# EAGLE schematic v.0.0.0 (EAGLE 5.11)

## Sheet 1 of 10
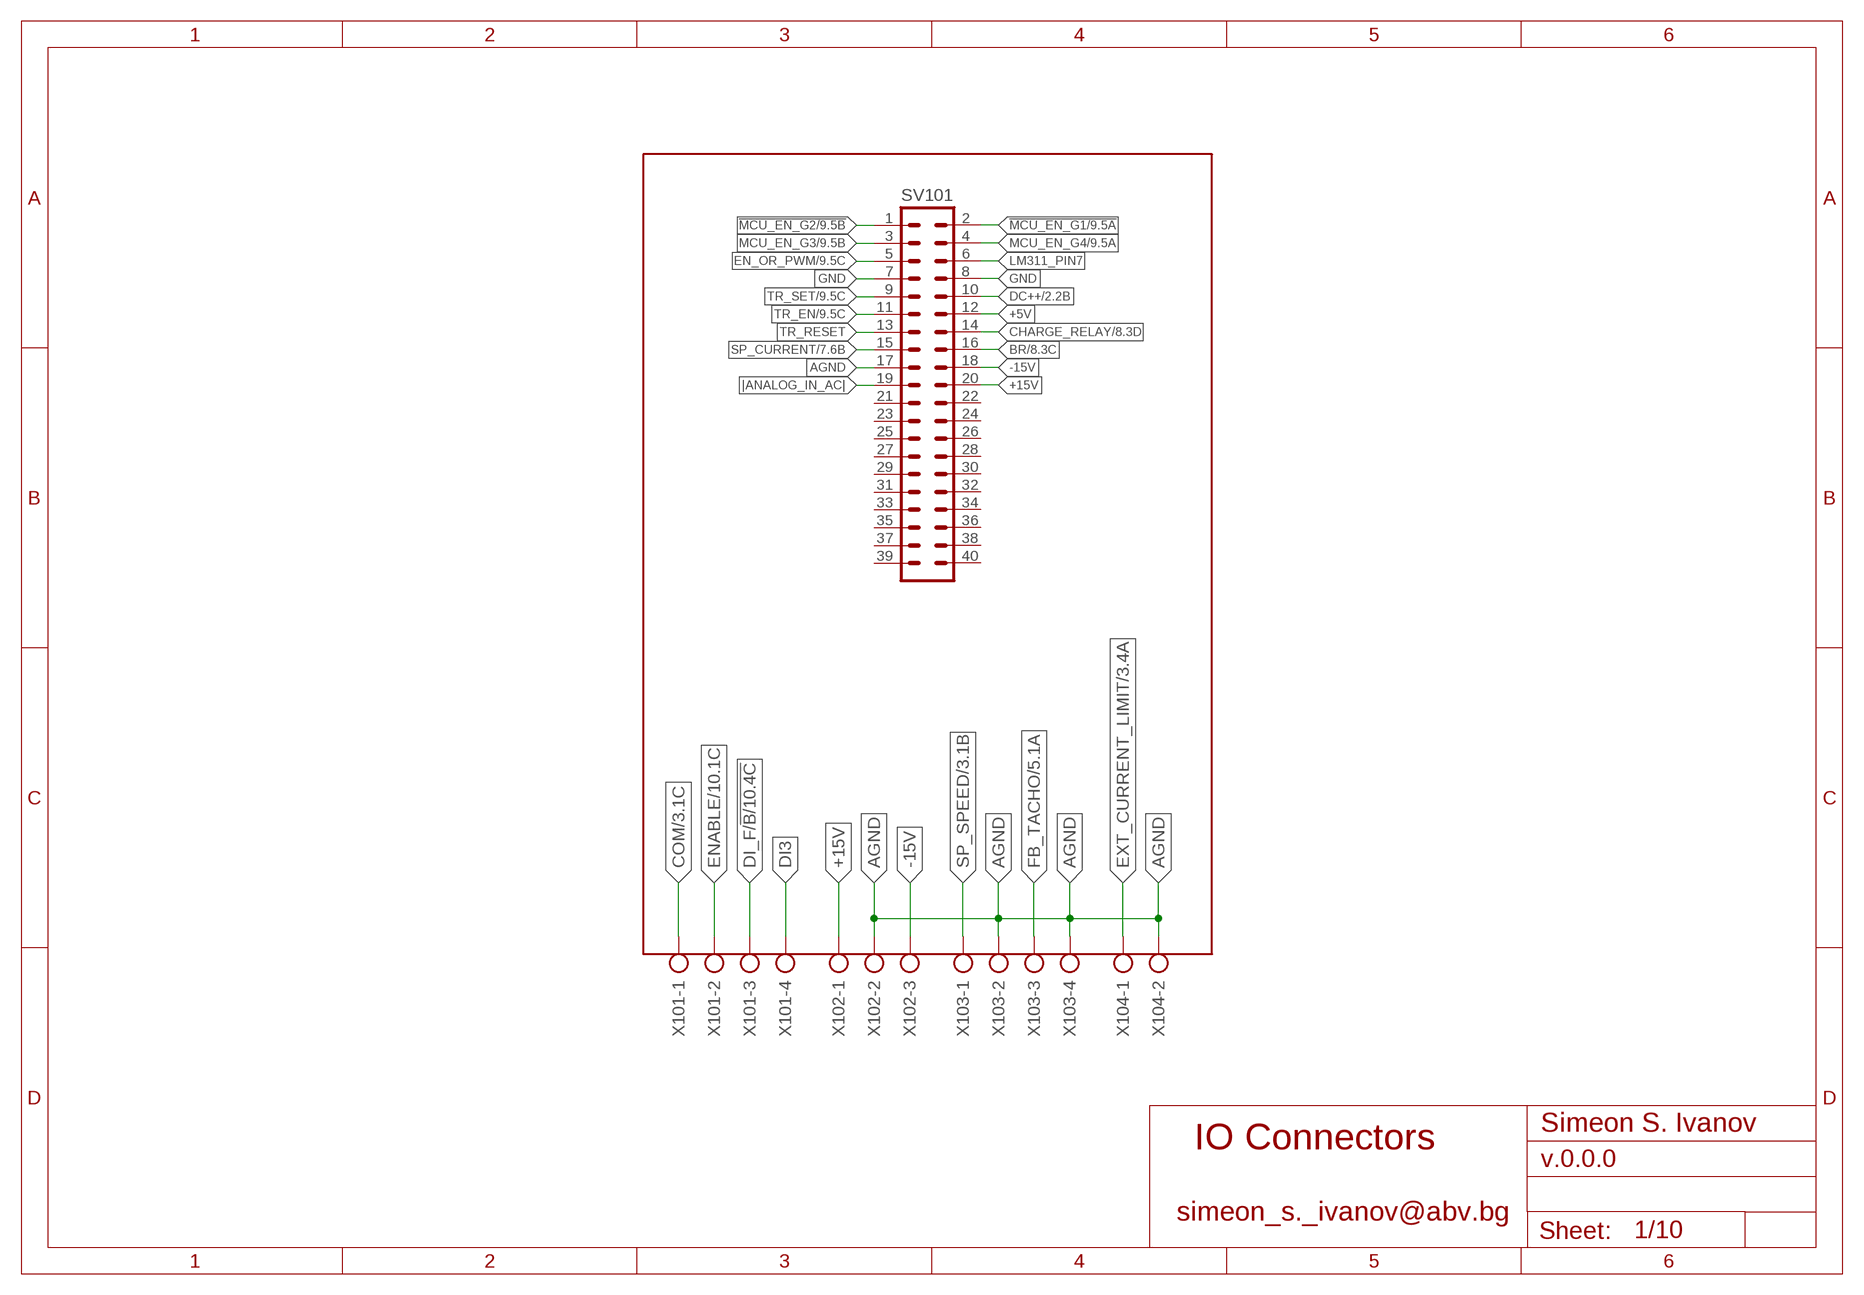
[diagram p0: schematic, sheet 1]

### Parts
SV101  ML40  [ML40]
X101  AK500/4-H  [AK500/4-H]
X102  AK500/3-H  [AK500/3-H]
X103  AK500/4-H  [AK500/4-H]
X104  AK500/2-H  [AK500/2-H]

### Nets
!MCU_EN_G1: SV101.2 ; also sheet 9
!MCU_EN_G2: SV101.1 ; also sheet 9
+5V: SV101.12 ; also sheet 2,8,9,10
+15V: SV101.20 X102.1 ; also sheet 2,3,4,5,6,7,8
-15V: SV101.18 X102.3 ; also sheet 2,3,4,5,6,7,8
AGND: SV101.17 X102.2 X103.2 X103.4 X104.2 ; also sheet 2,3,4,5,6,7,8
BR: SV101.16 ; also sheet 8
CHARGE_RELAY: SV101.14 ; also sheet 8
COM: X101.1 ; also sheet 3,10
DC++: SV101.10 ; also sheet 2,8
DI3: X101.4
DI_F/!B: X101.3 ; also sheet 10
EN_OR_PWM: SV101.5 ; also sheet 9
ENABLE: X101.2 ; also sheet 10
EXT_CURRENT_LIMIT: X104.1 ; also sheet 3
FB_TACHO: X103.3 ; also sheet 5
GND: SV101.7 SV101.8 ; also sheet 2,8,9,10
LM311_PIN7: SV101.6
MCU_EN_G3: SV101.3 ; also sheet 9
MCU_EN_G4: SV101.4 ; also sheet 9
SP_CURRENT: SV101.15 ; also sheet 7
SP_SPEED: X103.1 ; also sheet 3
TR_EN: SV101.11 ; also sheet 9
TR_RESET: SV101.13
TR_SET: SV101.9 ; also sheet 9
|ANALOG_IN_AC|: SV101.19
Unconnected: SV101.21 SV101.22 SV101.23 SV101.24 SV101.25 SV101.26 SV101.27 SV101.28 SV101.29 SV101.30 SV101.31 SV101.32 SV101.33 SV101.34 SV101.35 SV101.36 SV101.37 SV101.38 SV101.39 SV101.40

### Notes on the sheet
- Simeon S. Ivanov
- IO Connectors
- simeon_s._ivanov@abv.bg

## Sheet 2 of 10
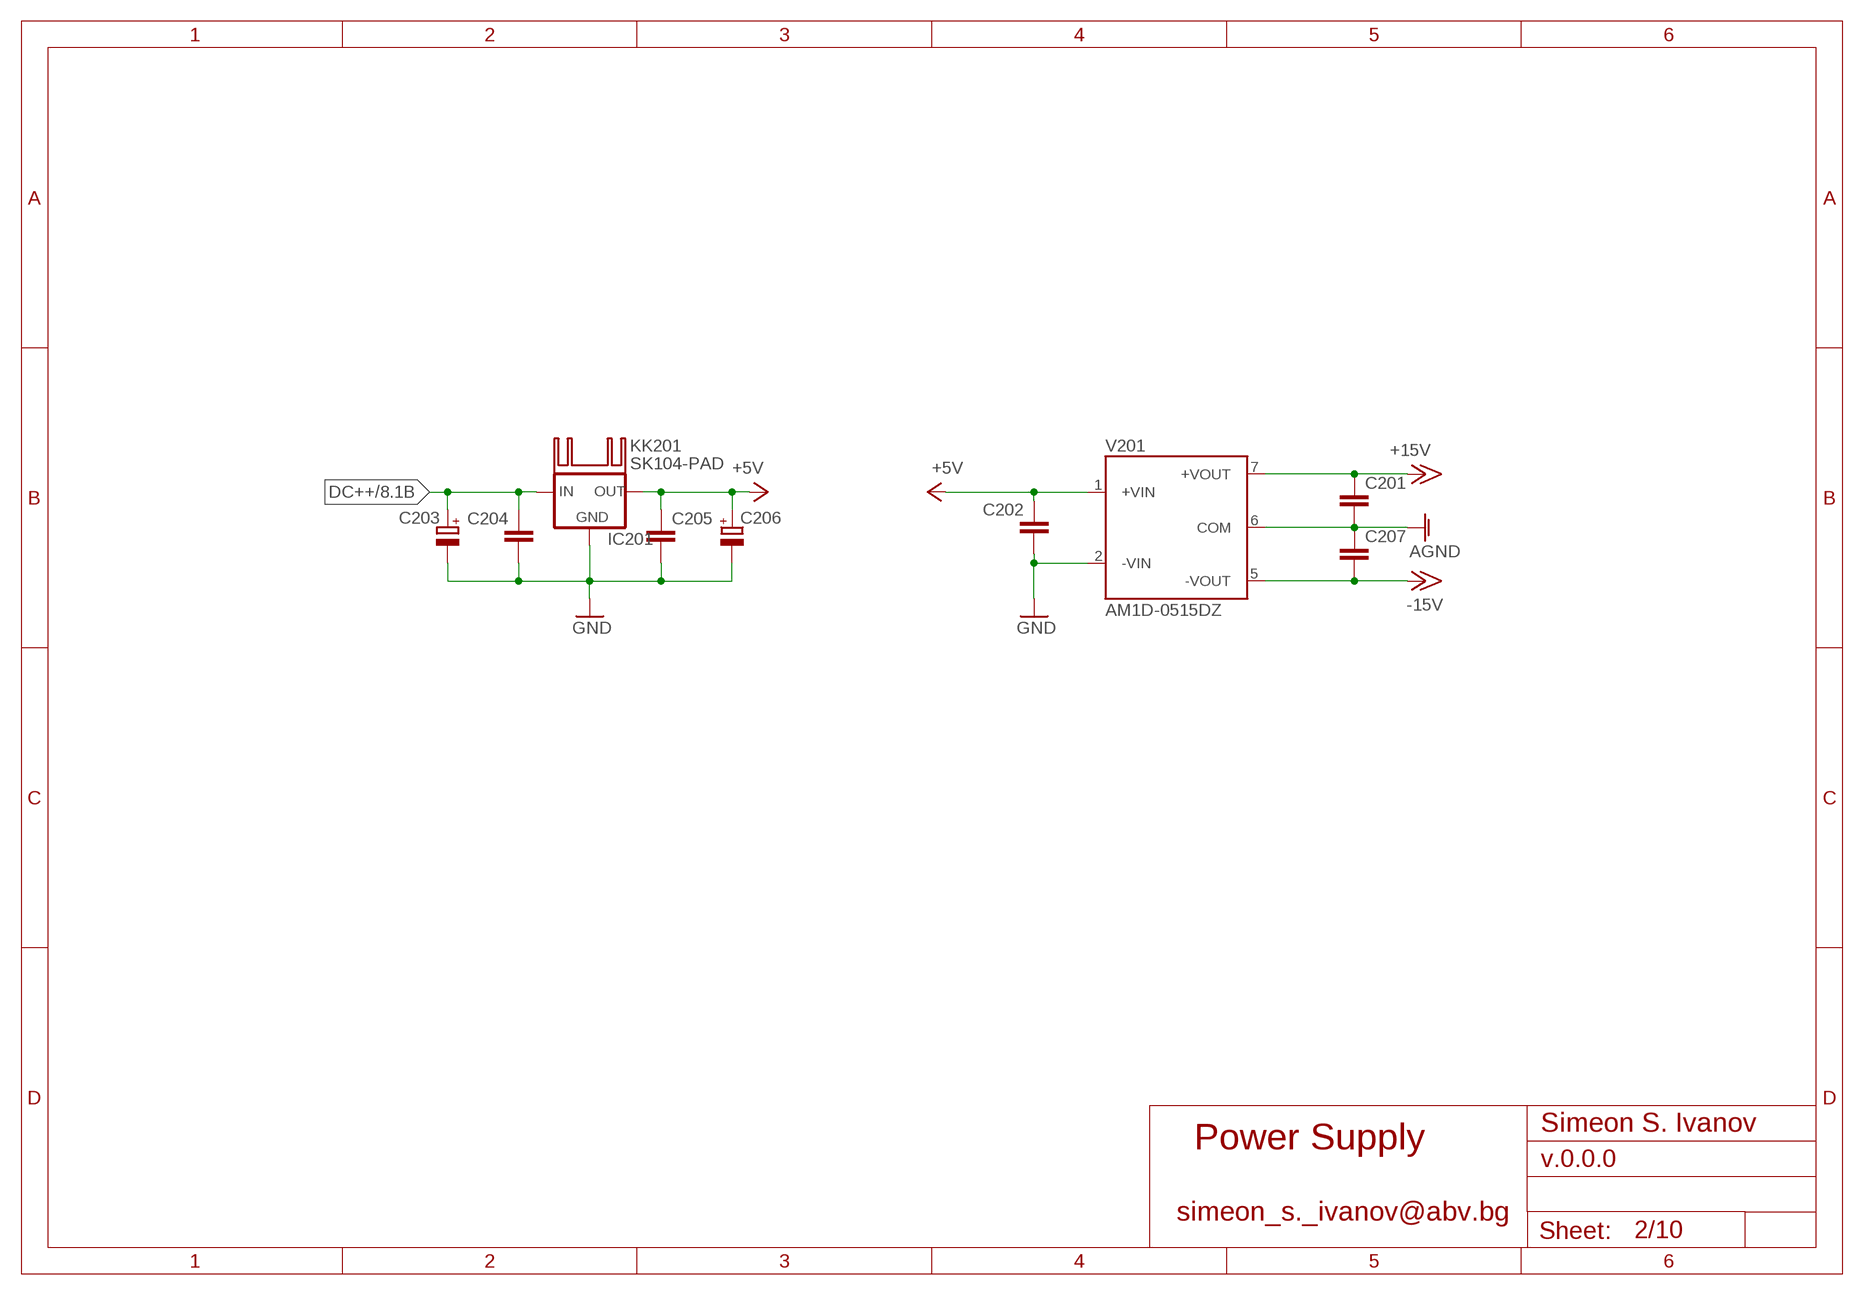
[diagram p1: schematic, sheet 2]

### Parts
C201  C-EUC1206  [C1206]
C202  C-EUC1206  [C1206]
C203  CPOL-EUE2.5-6  [E2,5-6]
C204  C-EUC1206  [C1206]
C205  C-EUC1206  [C1206]
C206  CPOL-EUE2.5-6  [E2,5-6]
C207  C-EUC1206  [C1206]
IC201  78XXS  [78XXS]
KK201  SK104-PAD  [SK104-PAD]
V201  AM1D-0515DZ  TMA0515D  [TMA_DUAL]

### Nets
+5V: C202.1 C205.1 C206.+ IC201.OUT V201.1(+VIN) ; also sheet 1,8,9,10
+15V: C201.1 V201.7(+VOUT) ; also sheet 1,3,4,5,6,7,8
-15V: C207.2 V201.5(-VOUT) ; also sheet 1,3,4,5,6,7,8
AGND: C201.2 C207.1 V201.6(COM) ; also sheet 1,3,4,5,6,7,8
DC++: C203.+ C204.1 IC201.IN ; also sheet 1,8
GND: C202.2 C203.- C204.2 C205.2 C206.- IC201.GND V201.2(-VIN) ; also sheet 1,8,9,10
Unconnected: KK201.K1(K) KK201.K2(K)

### Notes on the sheet
- Simeon S. Ivanov
- Power Supply
- simeon_s._ivanov@abv.bg

## Sheet 3 of 10
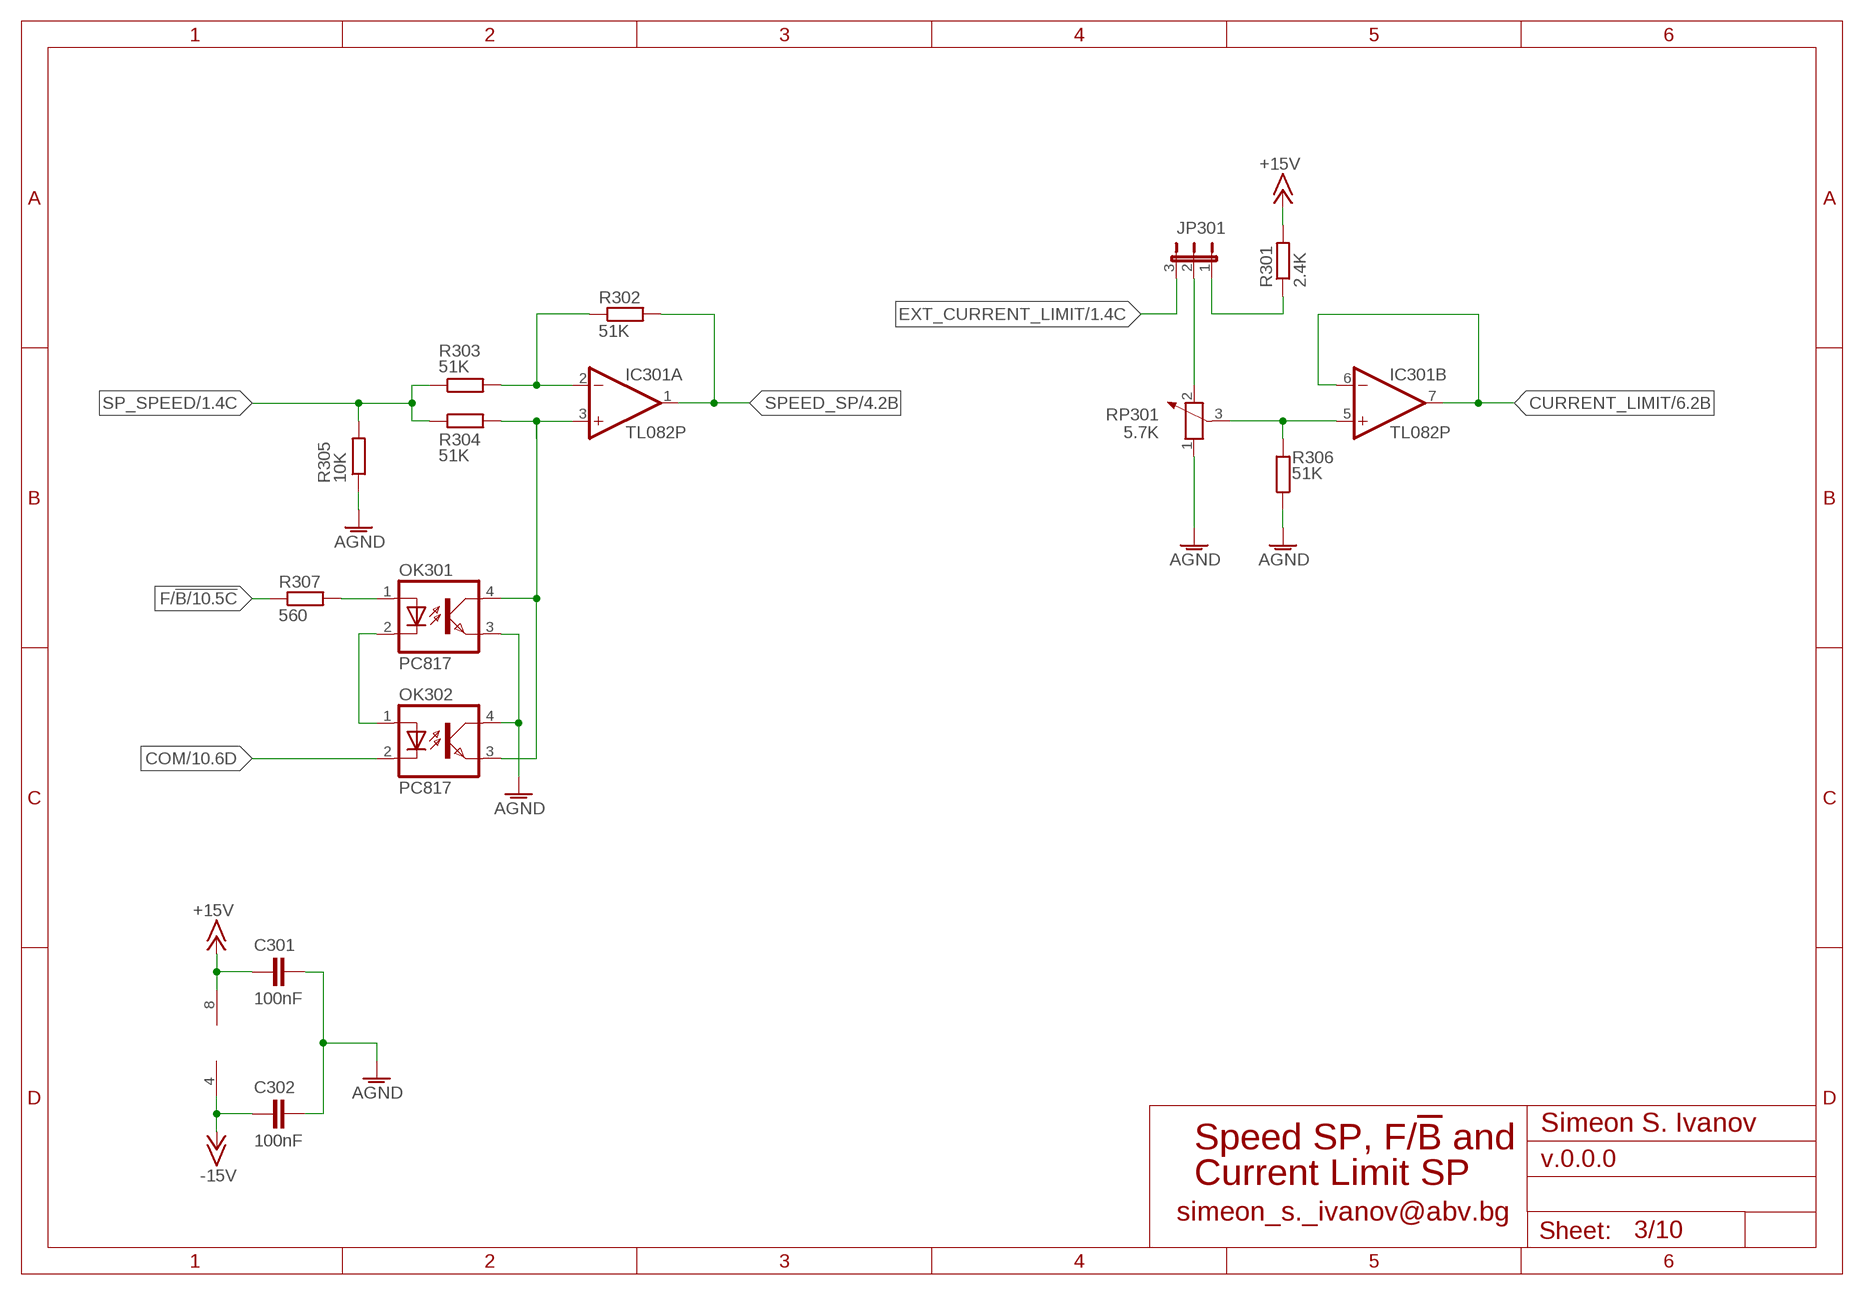
[diagram p2: schematic, sheet 3]

### Parts
C301  100nF  C-EUC0805  [C0805]
C302  100nF  C-EUC0805  [C0805]
IC301  TL082P  [DIL08]
JP301  JP2E  [JP2]
OK301  PC817  [DIL04]
OK302  PC817  [DIL04]
R301  2.4K  R-EU_0207/7  [0207/7]
R302  51K  R-EU_0207/7  [0207/7]
R303  51K  R-EU_0207/7  [0207/7]
R304  51K  R-EU_0207/7  [0207/7]
R305  10K  R-EU_0207/7  [0207/7]
R306  51K  R-EU_0207/7  [0207/7]
R307  560  R-EU_0207/7  [0207/7]
RP301  5.7K  POTENTIOMETER_PT-10  [PT-10]

### Nets
+15V: C301.1 IC301.8(P:V+) R301.2 ; also sheet 1,2,4,5,6,7,8
-15V: C302.1 IC301.4(P:V-) ; also sheet 1,2,4,5,6,7,8
AGND: C301.2 C302.2 OK301.3(EMIT) OK302.4(COL) R305.1 R306.1 RP301.1 ; also sheet 1,2,4,5,6,7,8
COM: OK302.2(C) ; also sheet 1,10
CURRENT_LIMIT: IC301.6(B:-IN) IC301.7(B:OUT) ; also sheet 6
EXT_CURRENT_LIMIT: JP301.3 ; also sheet 1
F/!B: R307.1 ; also sheet 10
N$10: JP301.2 RP301.2
N$24: JP301.1 R301.1
N$26: IC301.2(A:-IN) R302.1 R303.2
N$27: IC301.3(A:+IN) OK301.4(COL) OK302.3(EMIT) R304.2
N$46: IC301.5(B:+IN) R306.2 RP301.3
N$47: OK301.1(A) R307.2
N$49: OK301.2(C) OK302.1(A)
SP_SPEED: R303.1 R304.1 R305.2 ; also sheet 1
SPEED_SP: IC301.1(A:OUT) R302.2 ; also sheet 4

### Notes on the sheet
- Simeon S. Ivanov
- Speed SP, F/!B! and
- Current Limit SP
- simeon_s._ivanov@abv.bg

## Sheet 4 of 10
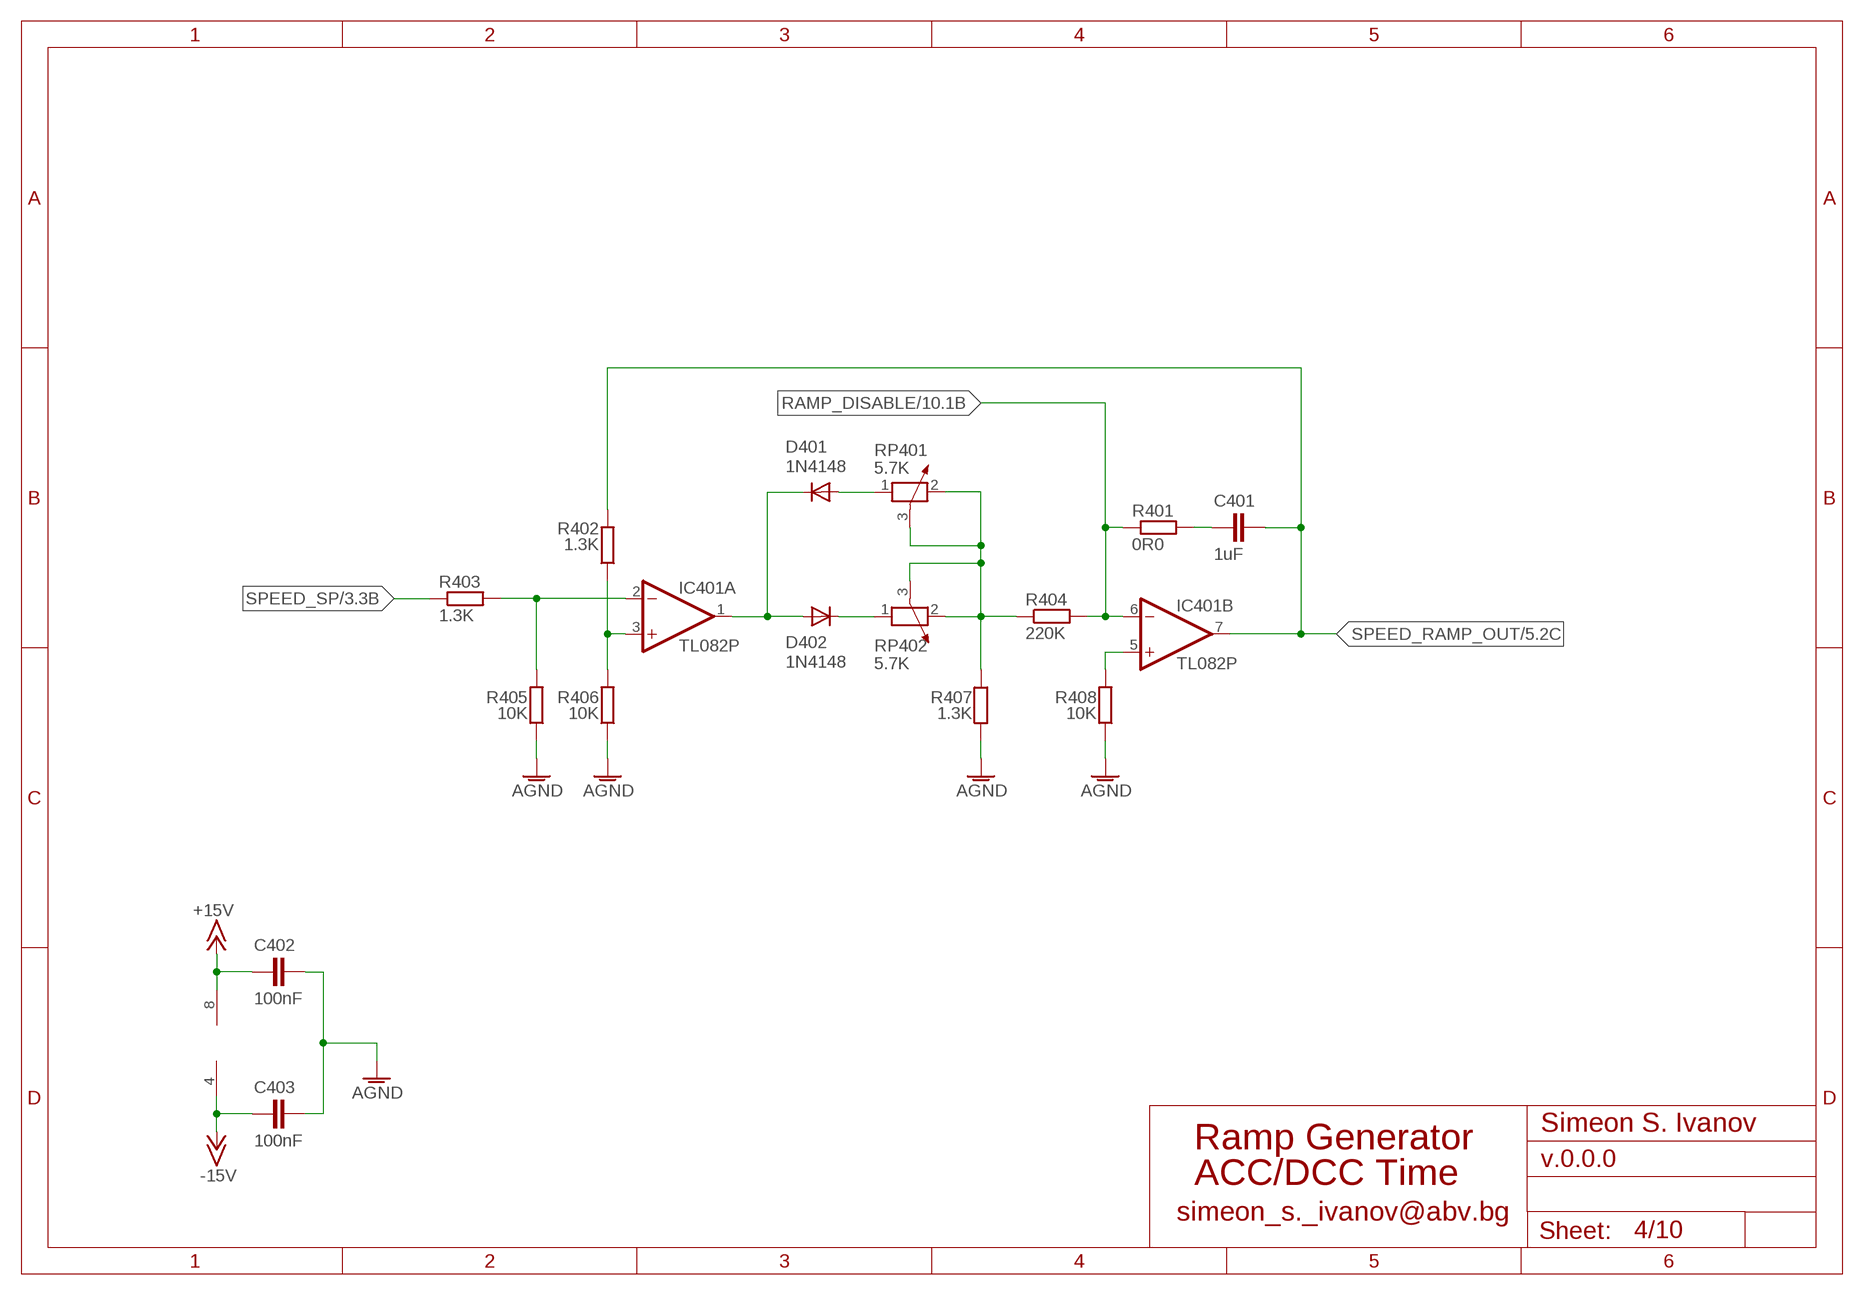
[diagram p3: schematic, sheet 4]

### Parts
C401  1uF  C-EU075-052X106  [C075-052X106]
C402  100nF  C-EUC0805  [C0805]
C403  100nF  C-EUC0805  [C0805]
D401  1N4148  1N4148DO35-10  [DO35-10]
D402  1N4148  1N4148DO35-10  [DO35-10]
IC401  TL082P  [DIL08]
R401  0R0  R-EU_0207/7  [0207/7]
R402  1.3K  R-EU_0207/7  [0207/7]
R403  1.3K  R-EU_0207/7  [0207/7]
R404  220K  R-EU_0207/7  [0207/7]
R405  10K  R-EU_0207/7  [0207/7]
R406  10K  R-EU_0207/7  [0207/7]
R407  1.3K  R-EU_0207/7  [0207/7]
R408  10K  R-EU_M0805  [M0805]
RP401  5.7K  POTENTIOMETER_PT-10  [PT-10]
RP402  5.7K  POTENTIOMETER_PT-10  [PT-10]

### Nets
+15V: C402.1 IC401.8(P:V+) ; also sheet 1,2,3,5,6,7,8
-15V: C403.1 IC401.4(P:V-) ; also sheet 1,2,3,5,6,7,8
AGND: C402.2 C403.2 R405.1 R406.1 R407.1 R408.1 ; also sheet 1,2,3,5,6,7,8
N$6: R404.1 R407.2 RP401.2 RP401.3 RP402.2 RP402.3
N$7: D402.C RP402.1
N$8: D401.A RP401.1
N$9: D401.C D402.A IC401.1(A:OUT)
N$11: IC401.3(A:+IN) R402.1 R406.2
N$12: IC401.2(A:-IN) R403.2 R405.2
N$14: C401.1 R401.2
N$151: IC401.5(B:+IN) R408.2
RAMP_DISABLE: IC401.6(B:-IN) R401.1 R404.2 ; also sheet 10
SPEED_RAMP_OUT: C401.2 IC401.7(B:OUT) R402.2 ; also sheet 5,10
SPEED_SP: R403.1 ; also sheet 3

### Notes on the sheet
- Simeon S. Ivanov
- Ramp Generator
- ACC/DCC Time
- simeon_s._ivanov@abv.bg

## Sheet 5 of 10
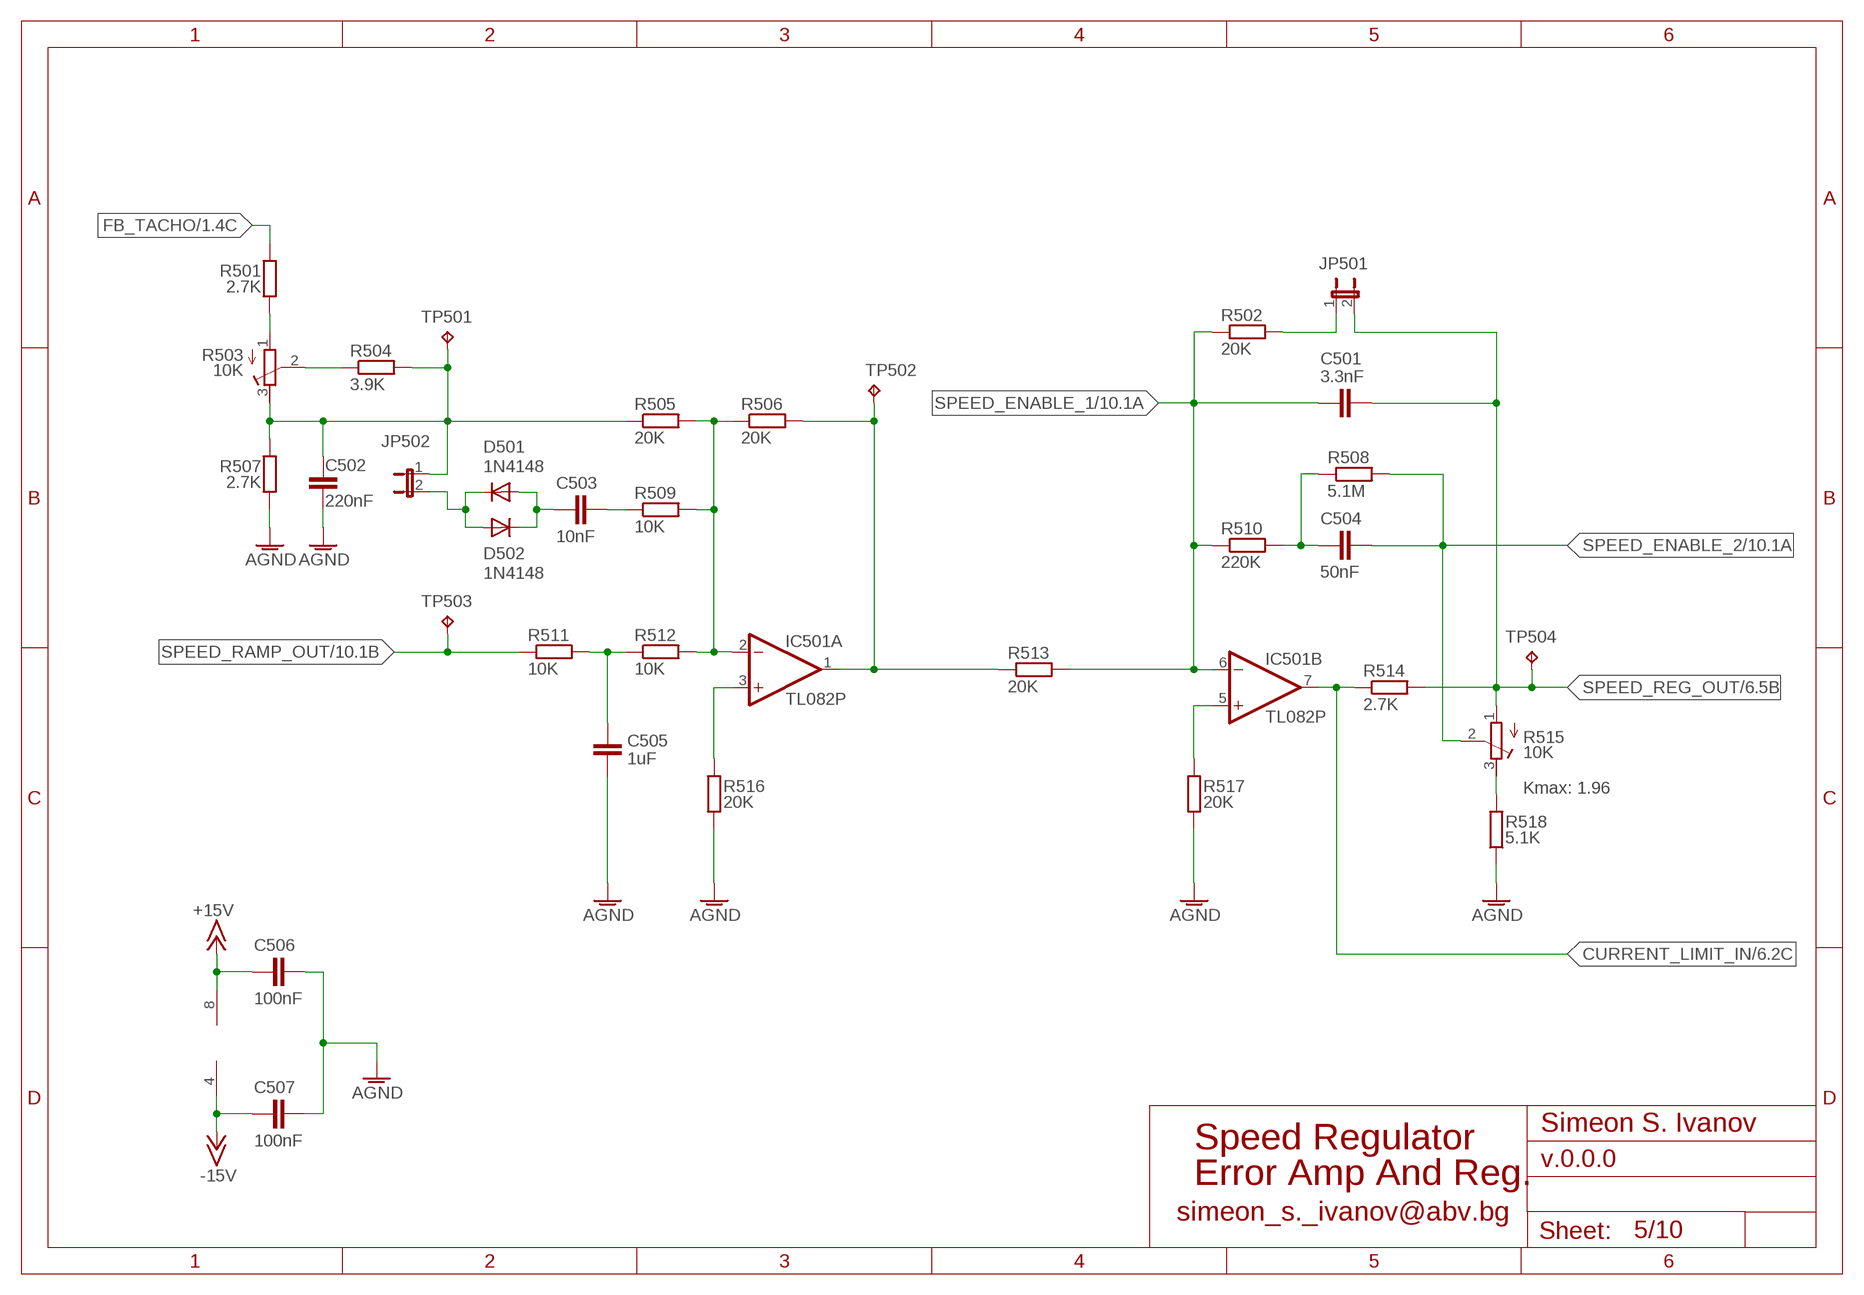
[diagram p4: schematic, sheet 5]

### Parts
C501  3.3nF  C-EU050-024X044  [C050-024X044]
C502  220nF  C-EU075-032X103  [C075-032X103]
C503  10nF  C-EU075-032X103  [C075-032X103]
C504  50nF  C-EU075-052X106  [C075-052X106]
C505  1uF  C-EU075-052X106  [C075-052X106]
C506  100nF  C-EUC0805  [C0805]
C507  100nF  C-EUC0805  [C0805]
D501  1N4148  1N4148DO35-7  [DO35-7]
D502  1N4148  1N4148DO35-7  [DO35-7]
IC501  TL082P  [DIL08]
JP501  JP1E  [JP1]
JP502  JP1E  [JP1]
R501  2.7K  R-EU_0207/7  [0207/7]
R502  20K  R-EU_0207/7  [0207/7]
R503  10K  R-TRIMM3296W  [RTRIM3296W]
R504  3.9K  R-EU_0207/7  [0207/7]
R505  20K  R-EU_0207/7  [0207/7]
R506  20K  R-EU_0207/7  [0207/7]
R507  2.7K  R-EU_0207/7  [0207/7]
R508  5.1M  R-EU_R1206  [R1206]
R509  10K  R-EU_0207/7  [0207/7]
R510  220K  R-EU_0207/7  [0207/7]
R511  10K  R-EU_0207/7  [0207/7]
R512  10K  R-EU_0207/7  [0207/7]
R513  20K  R-EU_0207/7  [0207/7]
R514  2.7K  R-EU_0207/7  [0207/7]
R515  10K  R-TRIMM3296W  [RTRIM3296W]
R516  20K  R-EU_R0805  [R0805]
R517  20K  R-EU_R0805  [R0805]
R518  5.1K  R-EU_0207/7  [0207/7]
TP501  TPPAD1-13  [P1-13]
TP502  TPPAD1-13  [P1-13]
TP503  TPPAD1-13  [P1-13]
TP504  TPPAD1-13  [P1-13]

### Nets
+15V: C506.1 IC501.8(P:V+) ; also sheet 1,2,3,4,6,7,8
-15V: C507.1 IC501.4(P:V-) ; also sheet 1,2,3,4,6,7,8
AGND: C502.1 C505.1 C506.2 C507.2 R507.1 R516.1 R517.1 R518.1 ; also sheet 1,2,3,4,6,7,8
CURRENT_LIMIT_IN: IC501.7(B:OUT) R514.1 ; also sheet 6
ERROR_OUT: IC501.1(A:OUT) R506.2 R513.1 TP502.TP
FB_TACHO: R501.2 ; also sheet 1
N$13: IC501.2(A:-IN) R505.2 R506.1 R509.2 R512.2
N$15: C505.2 R511.2 R512.1
N$17: R501.1 R503.1(E)
N$19: C504.1 R508.1 R510.2
N$20: C502.2 JP502.1 R503.3(A) R504.2 R505.1 R507.2 TP501.TP
N$21: JP501.1 R502.2
N$22: R515.3(A) R518.2
N$23: C503.2 R509.1
N$25: C503.1 D501.A D502.C
N$28: D501.C D502.A JP502.2
N$58: R503.2(S) R504.1
N$106: IC501.3(A:+IN) R516.2
N$150: IC501.5(B:+IN) R517.2
SPEED_ENABLE_1: C501.1 IC501.6(B:-IN) R502.1 R510.1 R513.2 ; also sheet 10
SPEED_ENABLE_2: C504.2 R508.2 R515.2(S) ; also sheet 10
SPEED_RAMP_OUT: R511.1 TP503.TP ; also sheet 4,10
SPEED_REG_OUT: C501.2 JP501.2 R514.2 R515.1(E) TP504.TP ; also sheet 6,7,8,10

### Notes on the sheet
- Kmax: 1.96
- Simeon S. Ivanov
- Speed Regulator
- Error Amp And Reg.
- simeon_s._ivanov@abv.bg

## Sheet 6 of 10
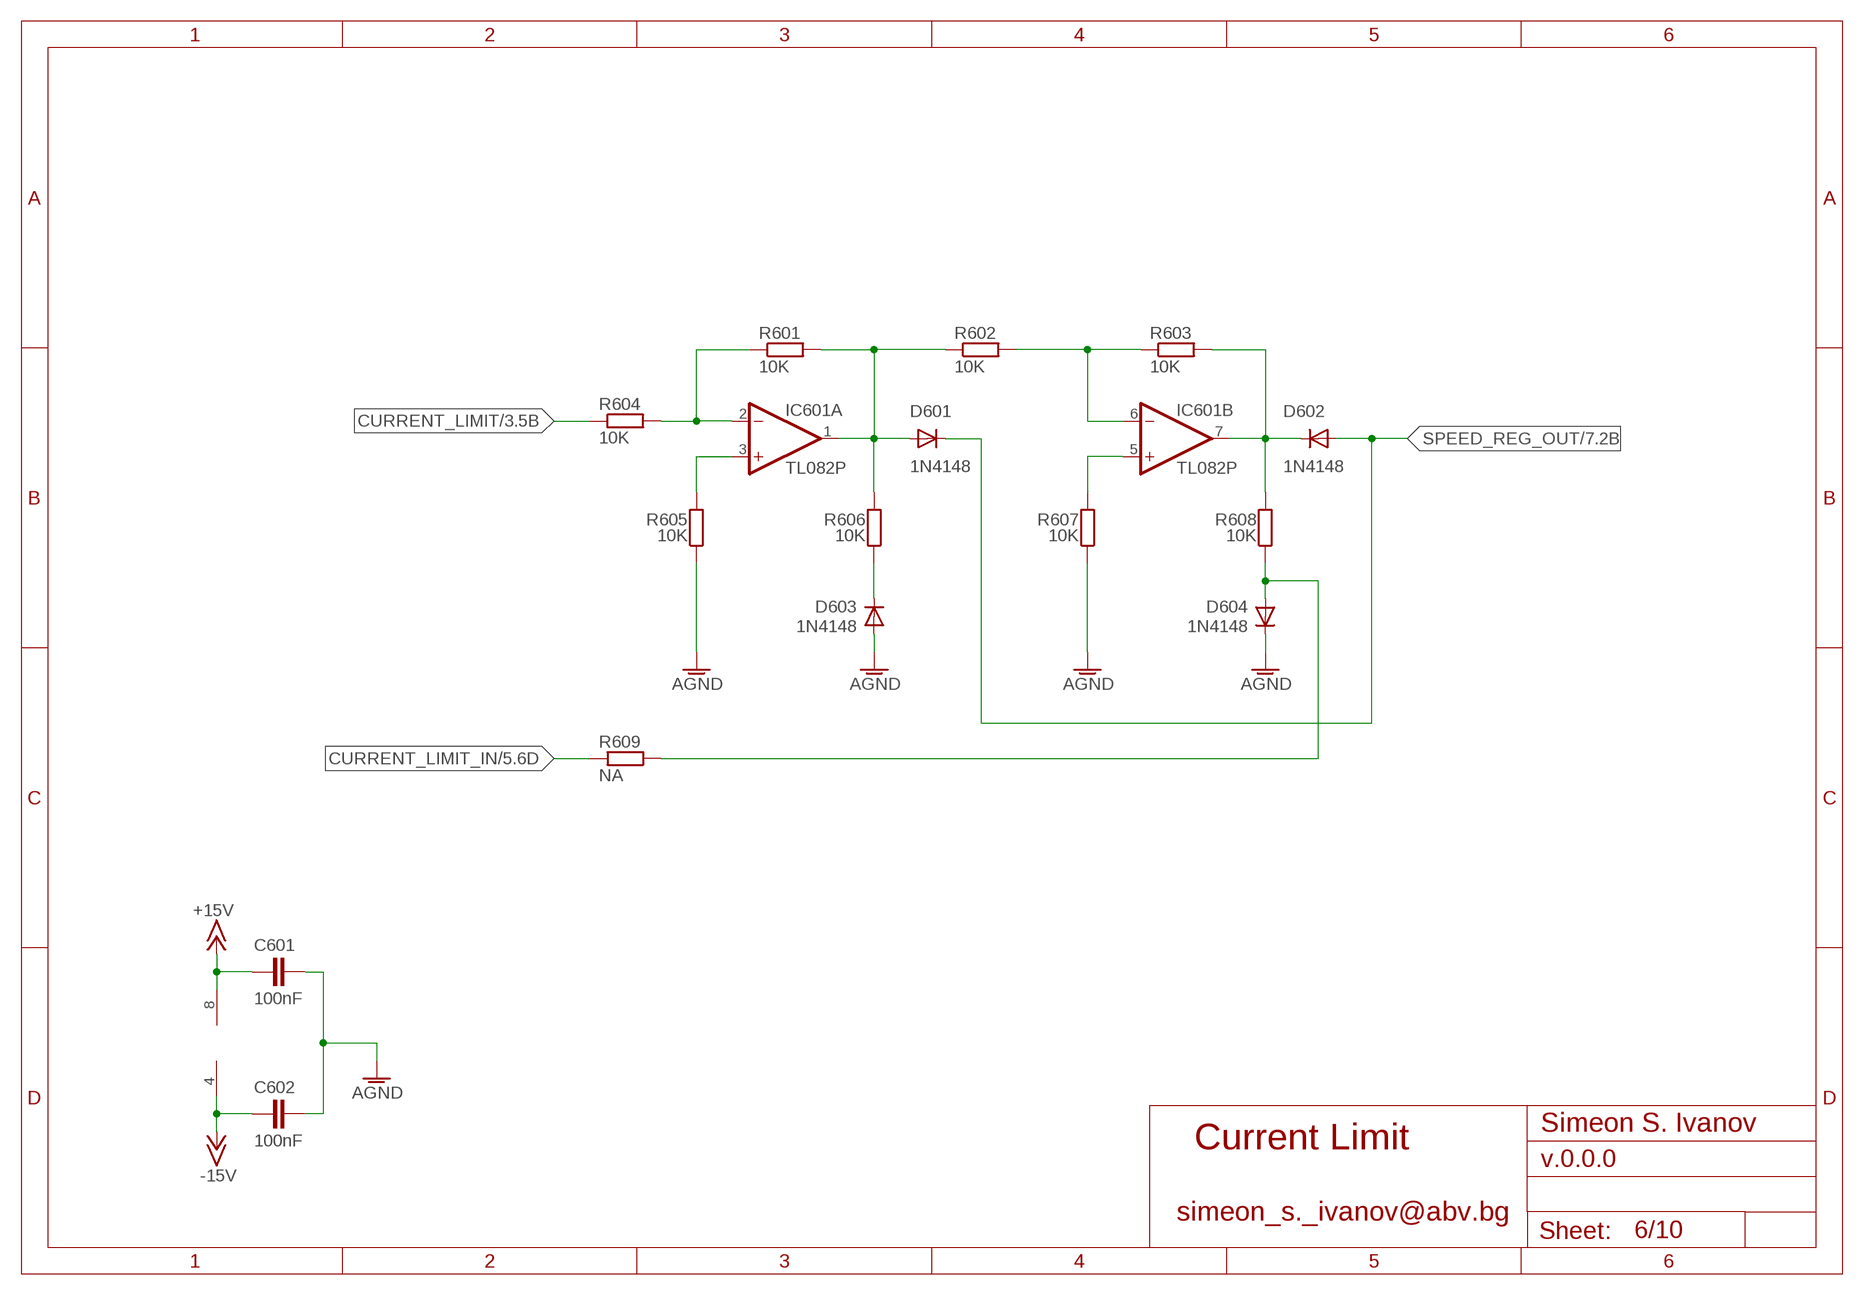
[diagram p5: schematic, sheet 6]

### Parts
C601  100nF  C-EUC0805  [C0805]
C602  100nF  C-EUC0805  [C0805]
D601  1N4148  1N4148DO35-7  [DO35-7]
D602  1N4148  1N4148DO35-7  [DO35-7]
D603  1N4148  1N4148DO35-7  [DO35-7]
D604  1N4148  1N4148DO35-7  [DO35-7]
IC601  TL082P  [DIL08]
R601  10K  R-EU_0207/7  [0207/7]
R602  10K  R-EU_0207/7  [0207/7]
R603  10K  R-EU_0207/7  [0207/7]
R604  10K  R-EU_0207/7  [0207/7]
R605  10K  R-EU_R0805  [R0805]
R606  10K  R-EU_0207/7  [0207/7]
R607  10K  R-EU_R0805  [R0805]
R608  10K  R-EU_0207/7  [0207/7]
R609  NA  R-EU_0207/7  [0207/7]

### Nets
+15V: C601.1 IC601.8(P:V+) ; also sheet 1,2,3,4,5,7,8
-15V: C602.1 IC601.4(P:V-) ; also sheet 1,2,3,4,5,7,8
AGND: C601.2 C602.2 D603.A D604.C R605.1 R607.1 ; also sheet 1,2,3,4,5,7,8
CURRENT_LIMIT: R604.1 ; also sheet 3
CURRENT_LIMIT_IN: R609.2 ; also sheet 5
N$51: IC601.2(A:-IN) R601.1 R604.2
N$53: D601.A IC601.1(A:OUT) R601.2 R602.1 R606.2
N$54: IC601.6(B:-IN) R602.2 R603.1
N$55: D602.C IC601.7(B:OUT) R603.2 R608.2
N$57: IC601.5(B:+IN) R607.2
N$61: IC601.3(A:+IN) R605.2
N$105: D603.C R606.1
N$121: D604.A R608.1 R609.1
SPEED_REG_OUT: D601.C D602.A ; also sheet 5,7,8,10

### Notes on the sheet
- Simeon S. Ivanov
- Current Limit
- simeon_s._ivanov@abv.bg

## Sheet 7 of 10
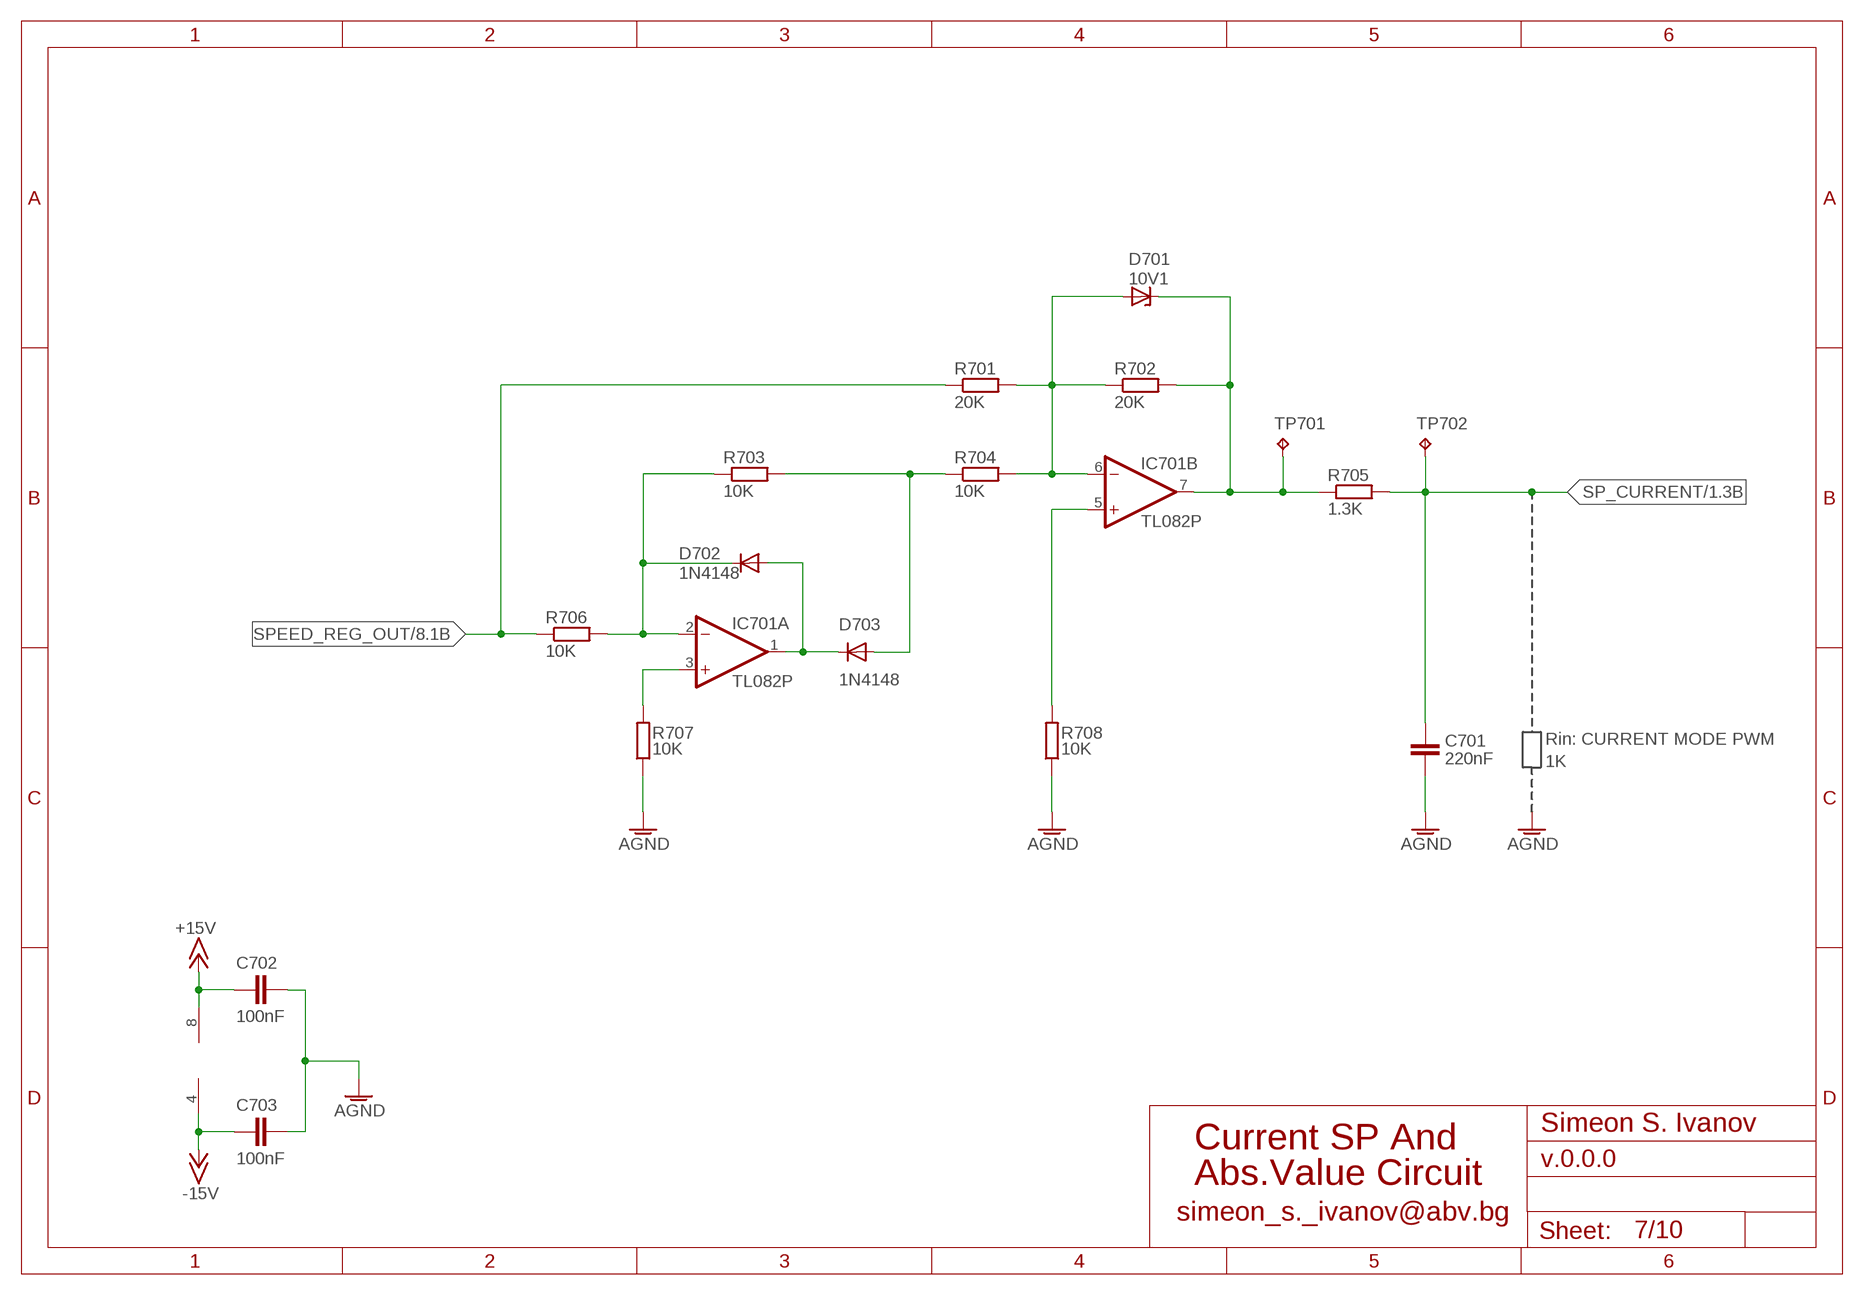
[diagram p6: schematic, sheet 7]

### Parts
C701  220nF  C-EU075-032X103  [C075-032X103]
C702  100nF  C-EUC0805  [C0805]
C703  100nF  C-EUC0805  [C0805]
D701  10V1  ZENER-DIODEZD-5  [ZDIO-5]
D702  1N4148  1N4148DO35-7  [DO35-7]
D703  1N4148  1N4148DO35-7  [DO35-7]
IC701  TL082P  [DIL08]
R701  20K  R-EU_0207/7  [0207/7]
R702  20K  R-EU_0207/7  [0207/7]
R703  10K  R-EU_0207/7  [0207/7]
R704  10K  R-EU_0207/7  [0207/7]
R705  1.3K  R-EU_0207/7  [0207/7]
R706  10K  R-EU_0207/7  [0207/7]
R707  10K  R-EU_R0805  [R0805]
R708  10K  R-EU_R0805  [R0805]
TP701  TPPAD1-13  [P1-13]
TP702  TPPAD1-13  [P1-13]

### Nets
+15V: C702.1 IC701.8(P:V+) ; also sheet 1,2,3,4,5,6,8
-15V: C703.1 IC701.4(P:V-) ; also sheet 1,2,3,4,5,6,8
AGND: C701.2 C702.2 C703.2 R707.1 R708.1 ; also sheet 1,2,3,4,5,6,8
N$30: D702.A D703.C IC701.1(A:OUT)
N$31: D702.C IC701.2(A:-IN) R703.1 R706.2
N$32: D703.A R703.2 R704.1
N$33: D701.A IC701.6(B:-IN) R701.2 R702.1 R704.2
N$178: IC701.3(A:+IN) R707.2
N$179: IC701.5(B:+IN) R708.2
SP_CURRENT: C701.1 R705.2 TP702.TP ; also sheet 1
SP_CURRENT_TO_RC: D701.C IC701.7(B:OUT) R702.2 R705.1 TP701.TP
SPEED_REG_OUT: R701.1 R706.1 ; also sheet 5,6,8,10

### Notes on the sheet
- Rin: CURRENT MODE PWM
- 1K
- Simeon S. Ivanov
- Current SP And
- Abs.Value Circuit
- simeon_s._ivanov@abv.bg

## Sheet 8 of 10
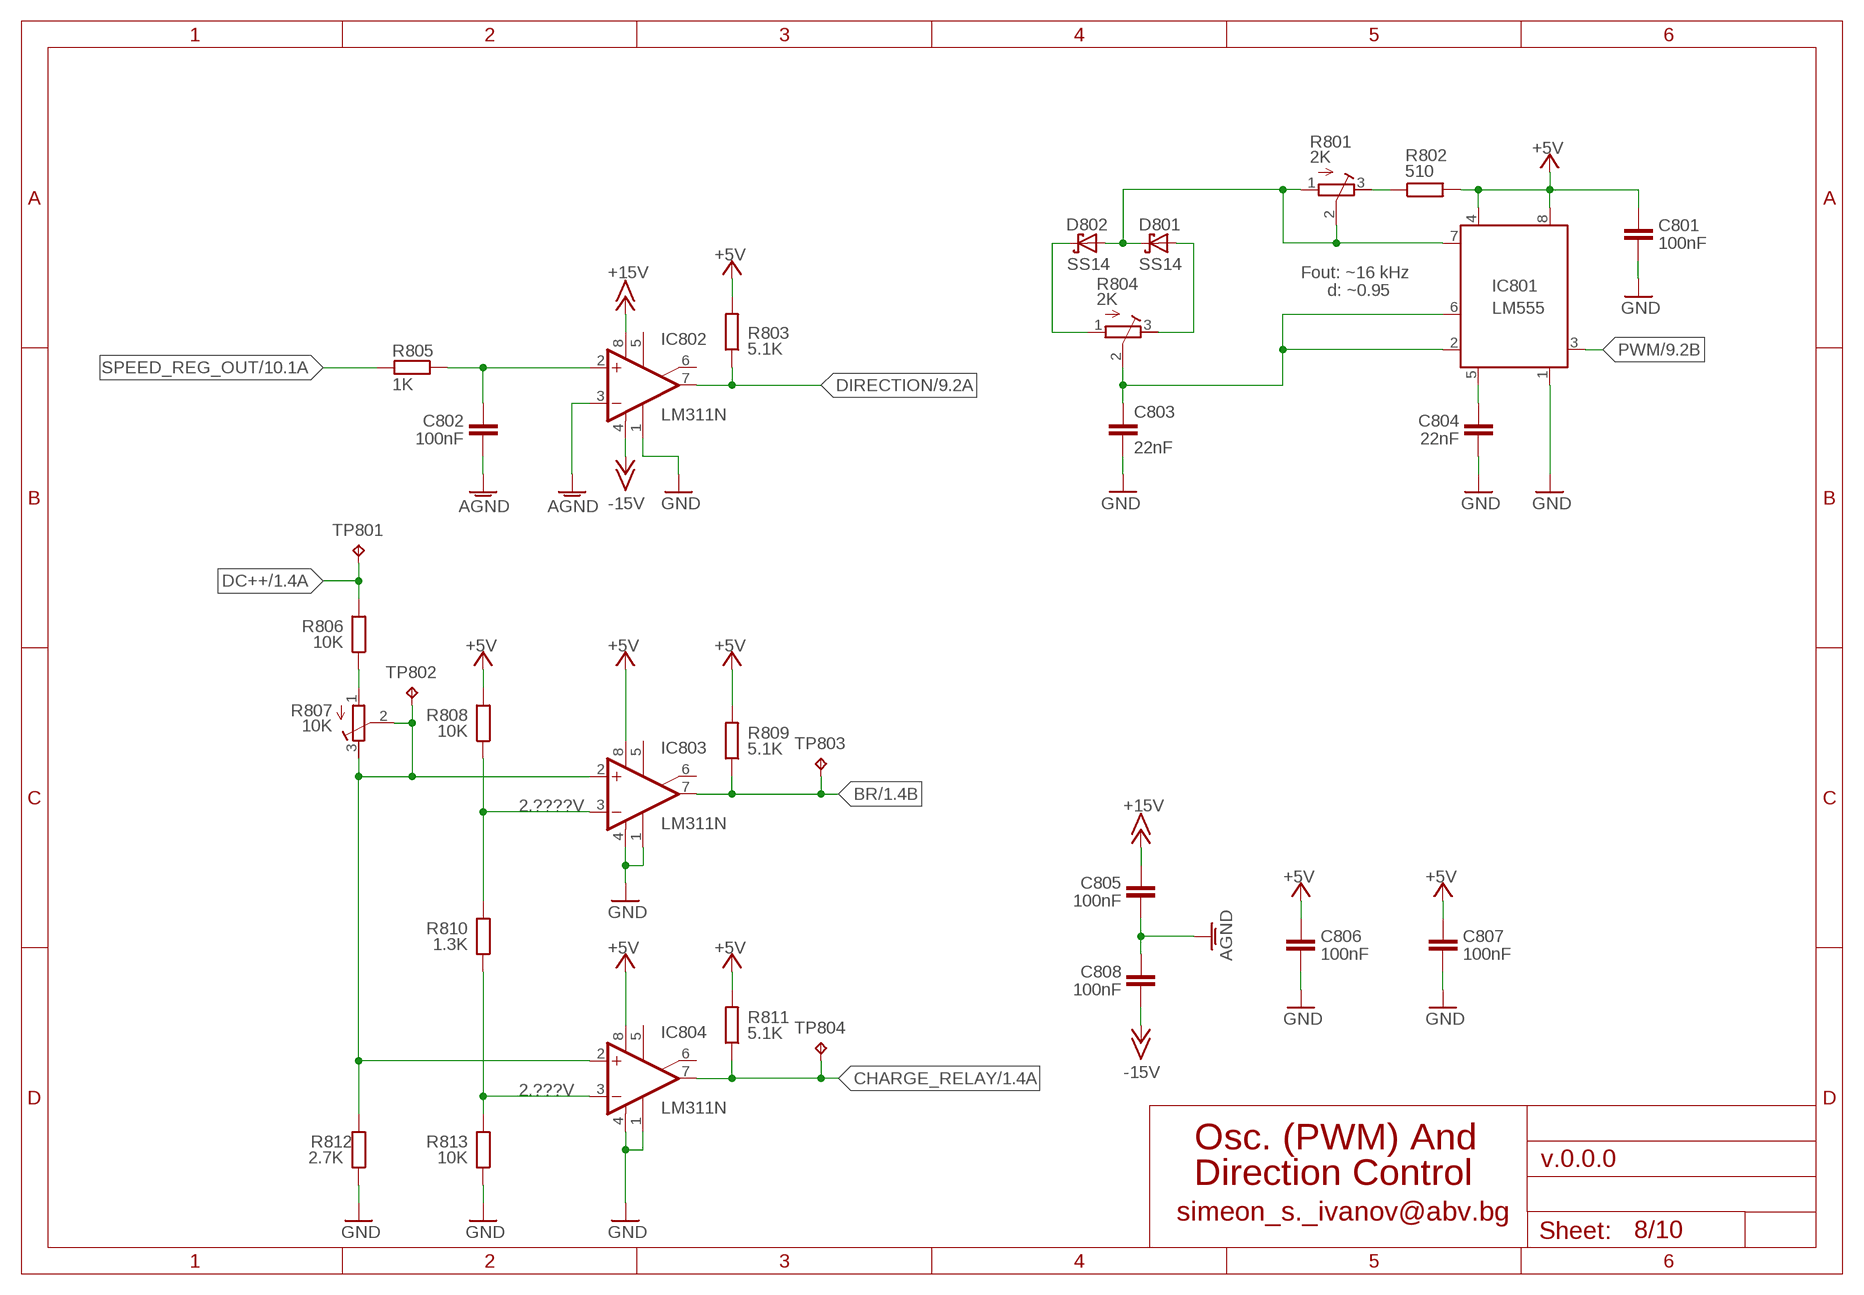
[diagram p7: schematic, sheet 8]

### Parts
C801  100nF  C-EUC0805  [C0805]
C802  100nF  C-EU075-032X103  [C075-032X103]
C803  22nF  C-EU050-024X044  [C050-024X044]
C804  22nF  C-EU050-024X044  [C050-024X044]
C805  100nF  C-EUC0805  [C0805]
C806  100nF  C-EUC0805  [C0805]
C807  100nF  C-EUC0805  [C0805]
C808  100nF  C-EUC0805  [C0805]
D801  SS14  SCHOTTKY-DIODESMD  [SMB]
D802  SS14  SCHOTTKY-DIODESMD  [SMB]
IC801  LM555  20  [DIL8-HOME]
IC802  LM311N  [DIL08]
IC803  LM311N  [DIL08]
IC804  LM311N  [DIL08]
R801  2K  R-TRIMM3296W  [RTRIM3296W]
R802  510  R-EU_0204/7  [0204/7]
R803  5.1K  R-EU_0204/7  [0204/7]
R804  2K  R-TRIMM3296W  [RTRIM3296W]
R805  1K  R-EU_0204/7  [0204/7]
R806  10K  R-EU_0207/10  [0207/10]
R807  10K  R-TRIMM3296W  [RTRIM3296W]
R808  10K  R-EU_0204/7  [0204/7]
R809  5.1K  R-EU_0204/7  [0204/7]
R810  1.3K  R-EU_0204/7  [0204/7]
R811  5.1K  R-EU_0204/7  [0204/7]
R812  2.7K  R-EU_0204/7  [0204/7]
R813  10K  R-EU_0204/7  [0204/7]
TP801  TPPAD1-13  [P1-13]
TP802  TPPAD1-13  [P1-13]
TP803  TPPAD1-13  [P1-13]
TP804  TPPAD1-13  [P1-13]

### Nets
2.????V: IC803.3(-IN) R808.1 R810.2
2.???V: IC804.3(-IN) R810.1 R813.2
+5V: C801.1 C806.1 C807.1 IC801.4 IC801.8 IC803.8(V+) IC804.8(V+) R802.2 R803.2 R808.2 R809.2 R811.2 ; also sheet 1,2,9,10
+15V: C805.1 IC802.8(V+) ; also sheet 1,2,3,4,5,6,7
-15V: C808.2 IC802.4(V-) ; also sheet 1,2,3,4,5,6,7
AGND: C802.2 C805.2 C808.1 IC802.3(-IN) ; also sheet 1,2,3,4,5,6,7
BR: IC803.7(OUT) R809.1 TP803.TP ; also sheet 1
CHARGE_RELAY: IC804.7(OUT) R811.1 TP804.TP ; also sheet 1
DC++: R806.2 TP801.TP ; also sheet 1,2
DIRECTION: IC802.7(OUT) R803.1 ; also sheet 9
GND: C801.2 C803.2 C804.2 C806.2 C807.2 IC801.1 IC802.1(GND) IC803.1(GND) IC803.4(V-) IC804.1(GND) IC804.4(V-) R812.1 R813.1 ; also sheet 1,2,9,10
N$34: C804.1 IC801.5
N$35: D801.C D802.A IC801.7 R801.1(E) R801.2(S)
N$36: D802.C R804.1(E)
N$37: D801.A R804.3(A)
N$40: C803.1 IC801.2 IC801.6 R804.2(S)
N$41: R801.3(A) R802.1
N$48: IC803.2(+IN) IC804.2(+IN) R807.2(S) R807.3(A) R812.2 TP802.TP
N$52: R806.1 R807.1(E)
N$97: C802.1 IC802.2(+IN) R805.1
PWM: IC801.3 ; also sheet 9
SPEED_REG_OUT: R805.2 ; also sheet 5,6,7,10
Unconnected: IC802.5(ON) IC802.6(ON/STR) IC803.5(ON) IC803.6(ON/STR) IC804.5(ON) IC804.6(ON/STR)

### Notes on the sheet
- Fout: ~16 kHz
- d: ~0.95
- Osc. (PWM) And
- Direction Control
- simeon_s._ivanov@abv.bg

## Sheet 9 of 10
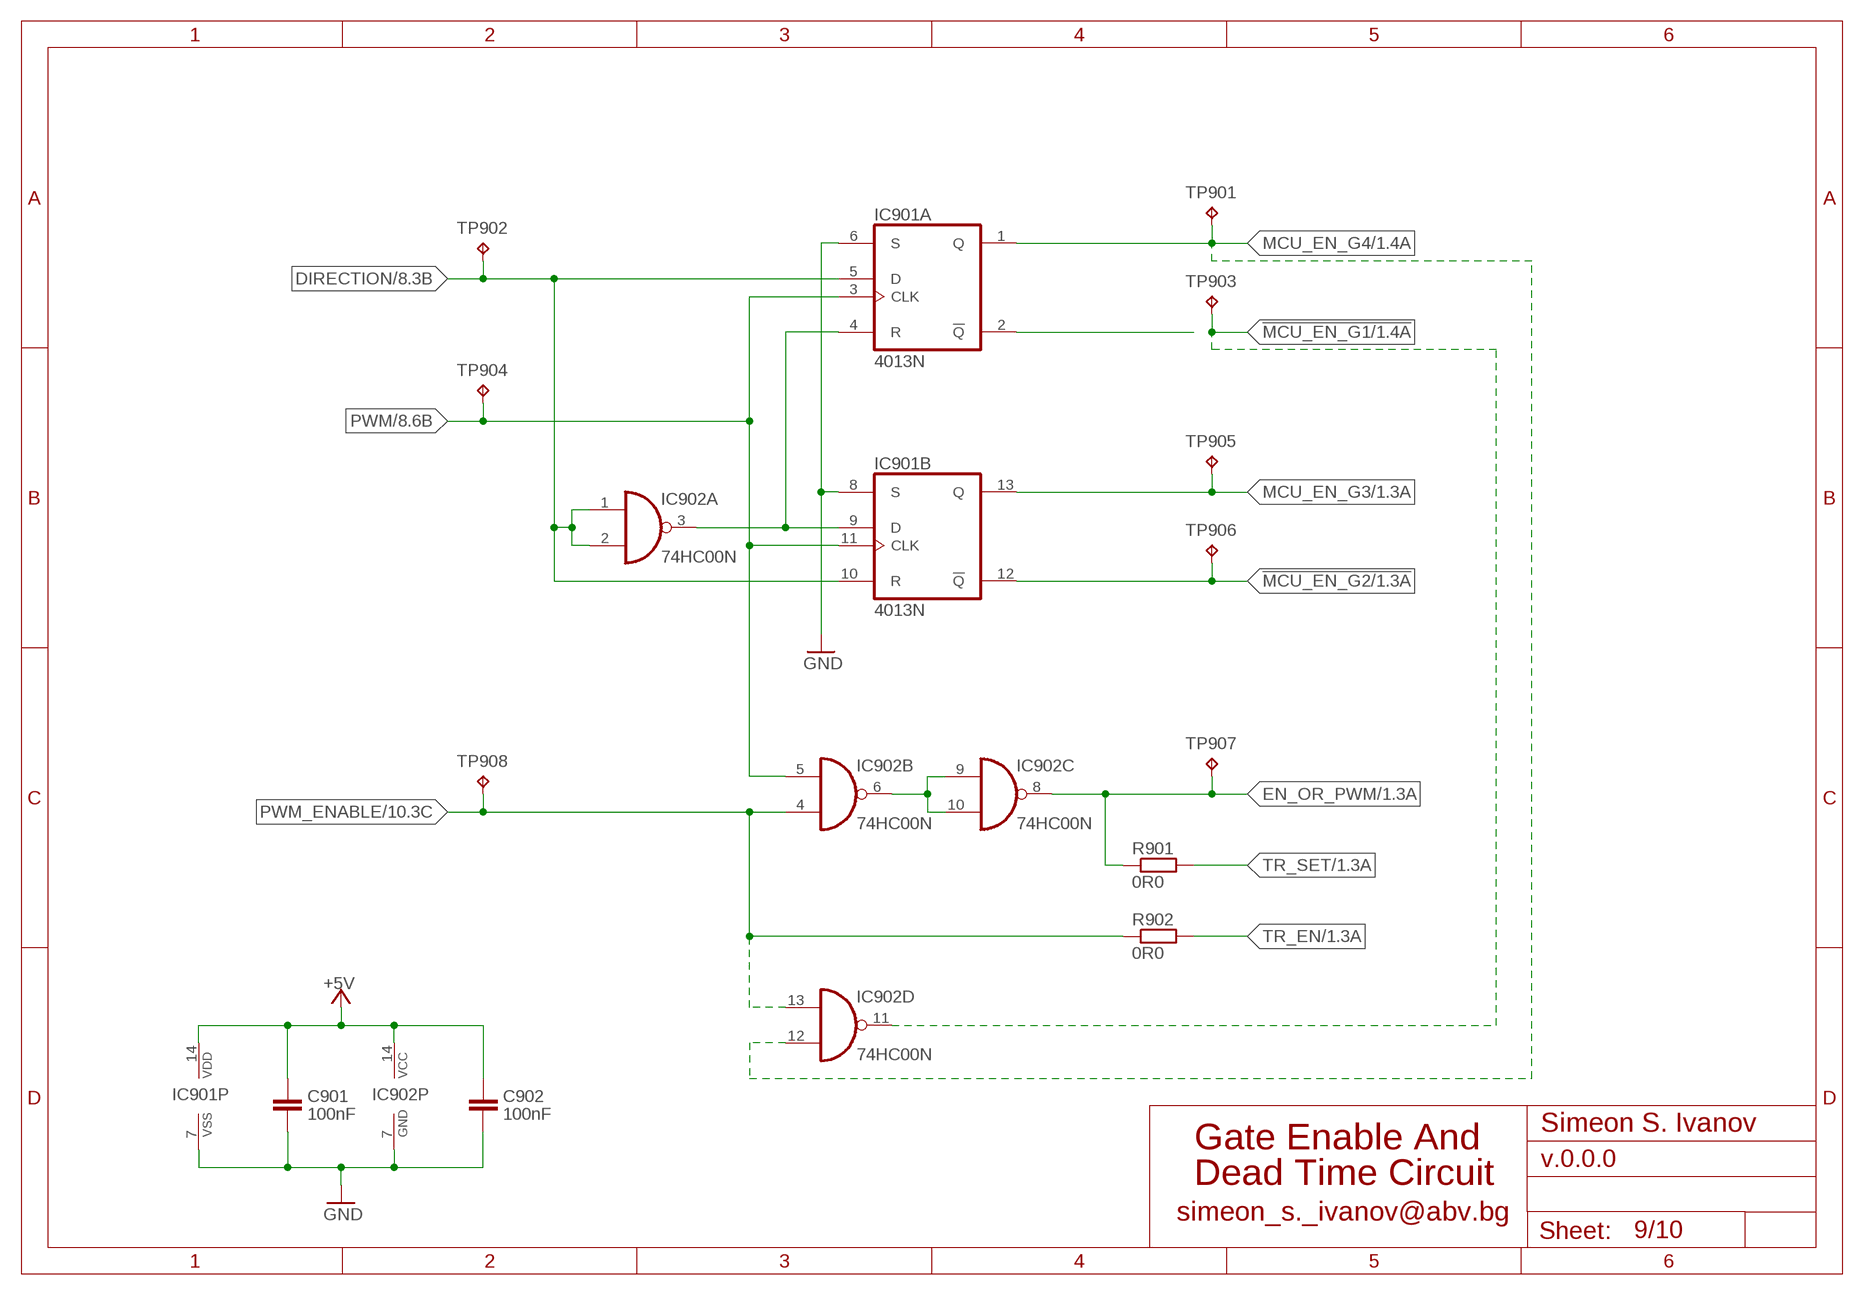
[diagram p8: schematic, sheet 9]

### Parts
C901  100nF  C-EUC0805  [C0805]
C902  100nF  C-EUC0805  [C0805]
IC901  4013N  [DIL14]
IC902  74HC00N  [DIL14]
R901  0R0  R-EU_0204/5  [0204/5]
R902  0R0  R-EU_0204/5  [0204/5]
TP901  TPPAD1-13  [P1-13]
TP902  TPPAD1-13  [P1-13]
TP903  TPPAD1-13  [P1-13]
TP904  TPPAD1-13  [P1-13]
TP905  TPPAD1-13  [P1-13]
TP906  TPPAD1-13  [P1-13]
TP907  TPPAD1-13  [P1-13]
TP908  TPPAD1-13  [P1-13]

### Nets
!MCU_EN_G1: IC902.11(D:O) TP903.TP ; also sheet 1
!MCU_EN_G2: IC901.12(B:!Q) TP906.TP ; also sheet 1
+5V: C901.1 C902.1 IC901.14(P:VDD) IC902.14(P:VCC) ; also sheet 1,2,8,10
DIRECTION: IC901.5(A:D) IC901.10(B:R) IC902.1(A:I0) IC902.2(A:I1) TP902.TP ; also sheet 8
EN_OR_PWM: IC902.8(C:O) R901.1 TP907.TP ; also sheet 1
GND: C901.2 C902.2 IC901.6(A:S) IC901.7(P:VSS) IC901.8(B:S) IC902.7(P:GND) ; also sheet 1,2,8,10
MCU_EN_G3: IC901.13(B:Q) TP905.TP ; also sheet 1
MCU_EN_G4: IC901.1(A:Q) IC902.12(D:I0) TP901.TP ; also sheet 1
N$16: IC901.4(A:R) IC901.9(B:D) IC902.3(A:O)
N$18: IC901.2(A:!Q)
N$29: IC902.6(B:O) IC902.9(C:I0) IC902.10(C:I1)
PWM: IC901.3(A:CLK) IC901.11(B:CLK) IC902.5(B:I1) TP904.TP ; also sheet 8
PWM_ENABLE: IC902.4(B:I0) IC902.13(D:I1) R902.1 TP908.TP ; also sheet 10
TR_EN: R902.2 ; also sheet 1
TR_SET: R901.2 ; also sheet 1

### Notes on the sheet
- Simeon S. Ivanov
- Gate Enable And
- Dead Time Circuit
- simeon_s._ivanov@abv.bg

## Sheet 10 of 10
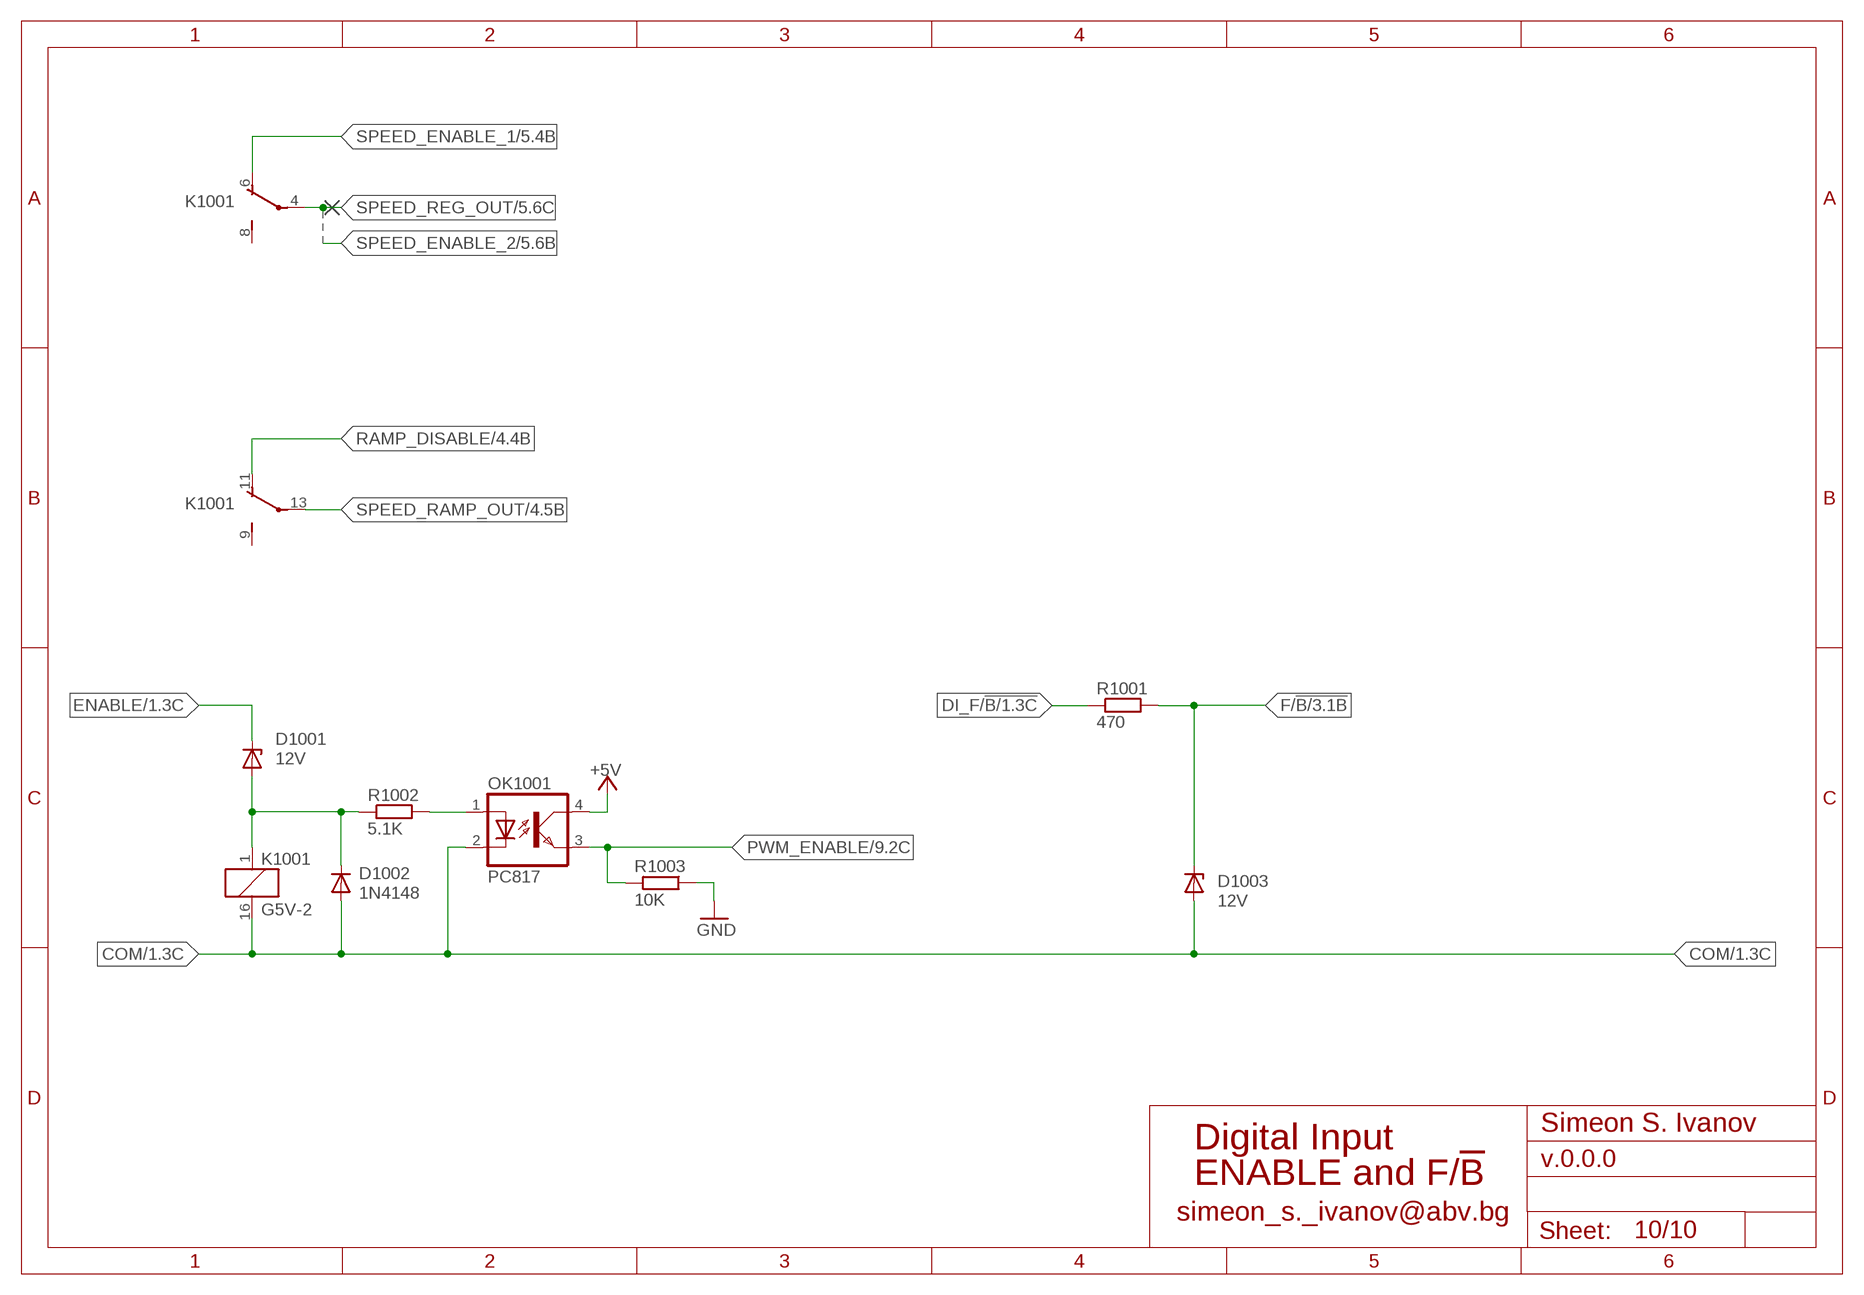
[diagram p9: schematic, sheet 10]

### Parts
D1001  12V  ZENER-DIODEZD-7.5  [ZDIO-7.5]
D1002  1N4148  1N4148DO35-7  [DO35-7]
D1003  12V  ZENER-DIODEZD-7.5  [ZDIO-7.5]
K1001  G5V-2  [G5V-2]
OK1001  PC817  [DIL04]
R1001  470  R-EU_0207/7  [0207/7]
R1002  5.1K  R-EU_0207/7  [0207/7]
R1003  10K  R-EU_0207/7  [0207/7]

### Nets
+5V: OK1001.4(COL) ; also sheet 1,2,8,9
COM: D1002.A D1003.A K1001.16 OK1001.2(C) ; also sheet 1,3
DI_F/!B: R1001.1 ; also sheet 1
ENABLE: D1001.C ; also sheet 1
F/!B: D1003.C R1001.2 ; also sheet 3
GND: R1003.1 ; also sheet 1,2,8,9
N$87: OK1001.1(A) R1002.2
N$88: D1001.A D1002.C K1001.1 R1002.1
PWM_ENABLE: OK1001.3(EMIT) R1003.2 ; also sheet 9
RAMP_DISABLE: K1001.11(2:O) ; also sheet 4
SPEED_ENABLE_1: K1001.6(1:O) ; also sheet 5
SPEED_RAMP_OUT: K1001.13(2:P) ; also sheet 4,5
SPEED_REG_OUT: K1001.4(1:P) ; also sheet 5,6,7,8
Unconnected: K1001.8(1:S) K1001.9(2:S)

### Notes on the sheet
- Simeon S. Ivanov
- Digital Input
- ENABLE and F/!B
- simeon_s._ivanov@abv.bg

## Library data of the parts
C201 C202 C204 C205 C207 C301 C302 C401-C403 C501-C507 C601 C602 C701-C703 C801-C808 C901 C902 = rcl:C-EU: CAPACITOR, European symbol
C203 C206 = rcl:CPOL-EU: POLARIZED CAPACITOR, European symbol
D401 D402 D501 D502 D601-D604 D702 D703 D1002 = diode:1N4148: DIODE high speed (Philips)
D701 D1001 D1003 = diode:ZENER-DIODE: Z-Diode
D801 D802 = diode:SCHOTTKY-DIODE: Schottky Diode
IC201 = v-reg:78XXS: VOLTAGE REGULATOR
IC301 IC401 IC501 IC601 IC701 = linear:TL082: OP AMP
IC801 = 555:2
IC802-IC804 = linear:LM311: COMPARATOR
IC901 = 40xx:4013: Dual D FLIP FLOP, set/reset
IC902 = 74xx-eu:74*00: Quad 2-input NAND gate
JP301 = jumper:JP2E: JUMPER
JP501 JP502 = jumper:JP1E: JUMPER
K1001 = relay:G5V-2: OMRON PCB Relay Source: http://www.omron.com/ecb/products/pdf/en-g5v2.pdf; MPN: G5V-2 5DC; OC_FARNELL: 9949488; OC_NEWARK: 78K5703
KK201 = heatsink:SK104-PAD: HEATSINK manufacturer Fischer/distributor Buerklin
OK301 OK302 OK1001 = optocoupler:PC817: SHARP OPTO COUPLER; MPN: PC817X4J000F; OC_FARNELL: 9707727; OC_NEWARK: 97K7059
R301-R307 R401-R408 R501 R502 R504-R514 R516-R518 R601-R609 R701-R708 R802 R803 R805 R806 R808-R813 R901 R902 R1001-R1003 = rcl:R-EU_: RESISTOR, European symbol
R503 R515 R801 R804 R807 = rcl:R-TRIMM: Trimm resistor
RP301 RP401 RP402 = rcl:POTENTIOMETER_: Potentiometer
SV101 = con-harting-ml:ML40: HARTING; OC_FARNELL: unknown; OC_NEWARK: unknown
TP501-TP504 TP701 TP702 TP801-TP804 TP901-TP908 = testpad:TP: Test pad
V201 = myTraco-electronic:TMA*?
X101 X103 = con-ptr500:AK500/4-H: CONNECTOR Aug. 2004 / PTR Meßtechnik: Die Bezeichnung der Serie AK505 wurde geändert. Es handelt sich hierbei um AK500 in horizontaler Ausführung.; OC_FARNELL: unknown; OC_NEWARK: unknown
X102 = con-ptr500:AK500/3-H: CONNECTOR Aug. 2004 / PTR Meßtechnik: Die Bezeichnung der Serie AK505 wurde geändert. Es handelt sich hierbei um AK500 in horizontaler Ausführung.; OC_FARNELL: unknown; OC_NEWARK: unknown
X104 = con-ptr500:AK500/2-H: CONNECTOR Aug. 2004 / PTR Meßtechnik: Die Bezeichnung der Serie AK505 wurde geändert. Es handelt sich hierbei um AK500 in horizontaler Ausführung.; OC_FARNELL: unknown; OC_NEWARK: unknown